# EAGLE design IMU CAN Speed Converter Board rev2 (EAGLE 9.6.2)
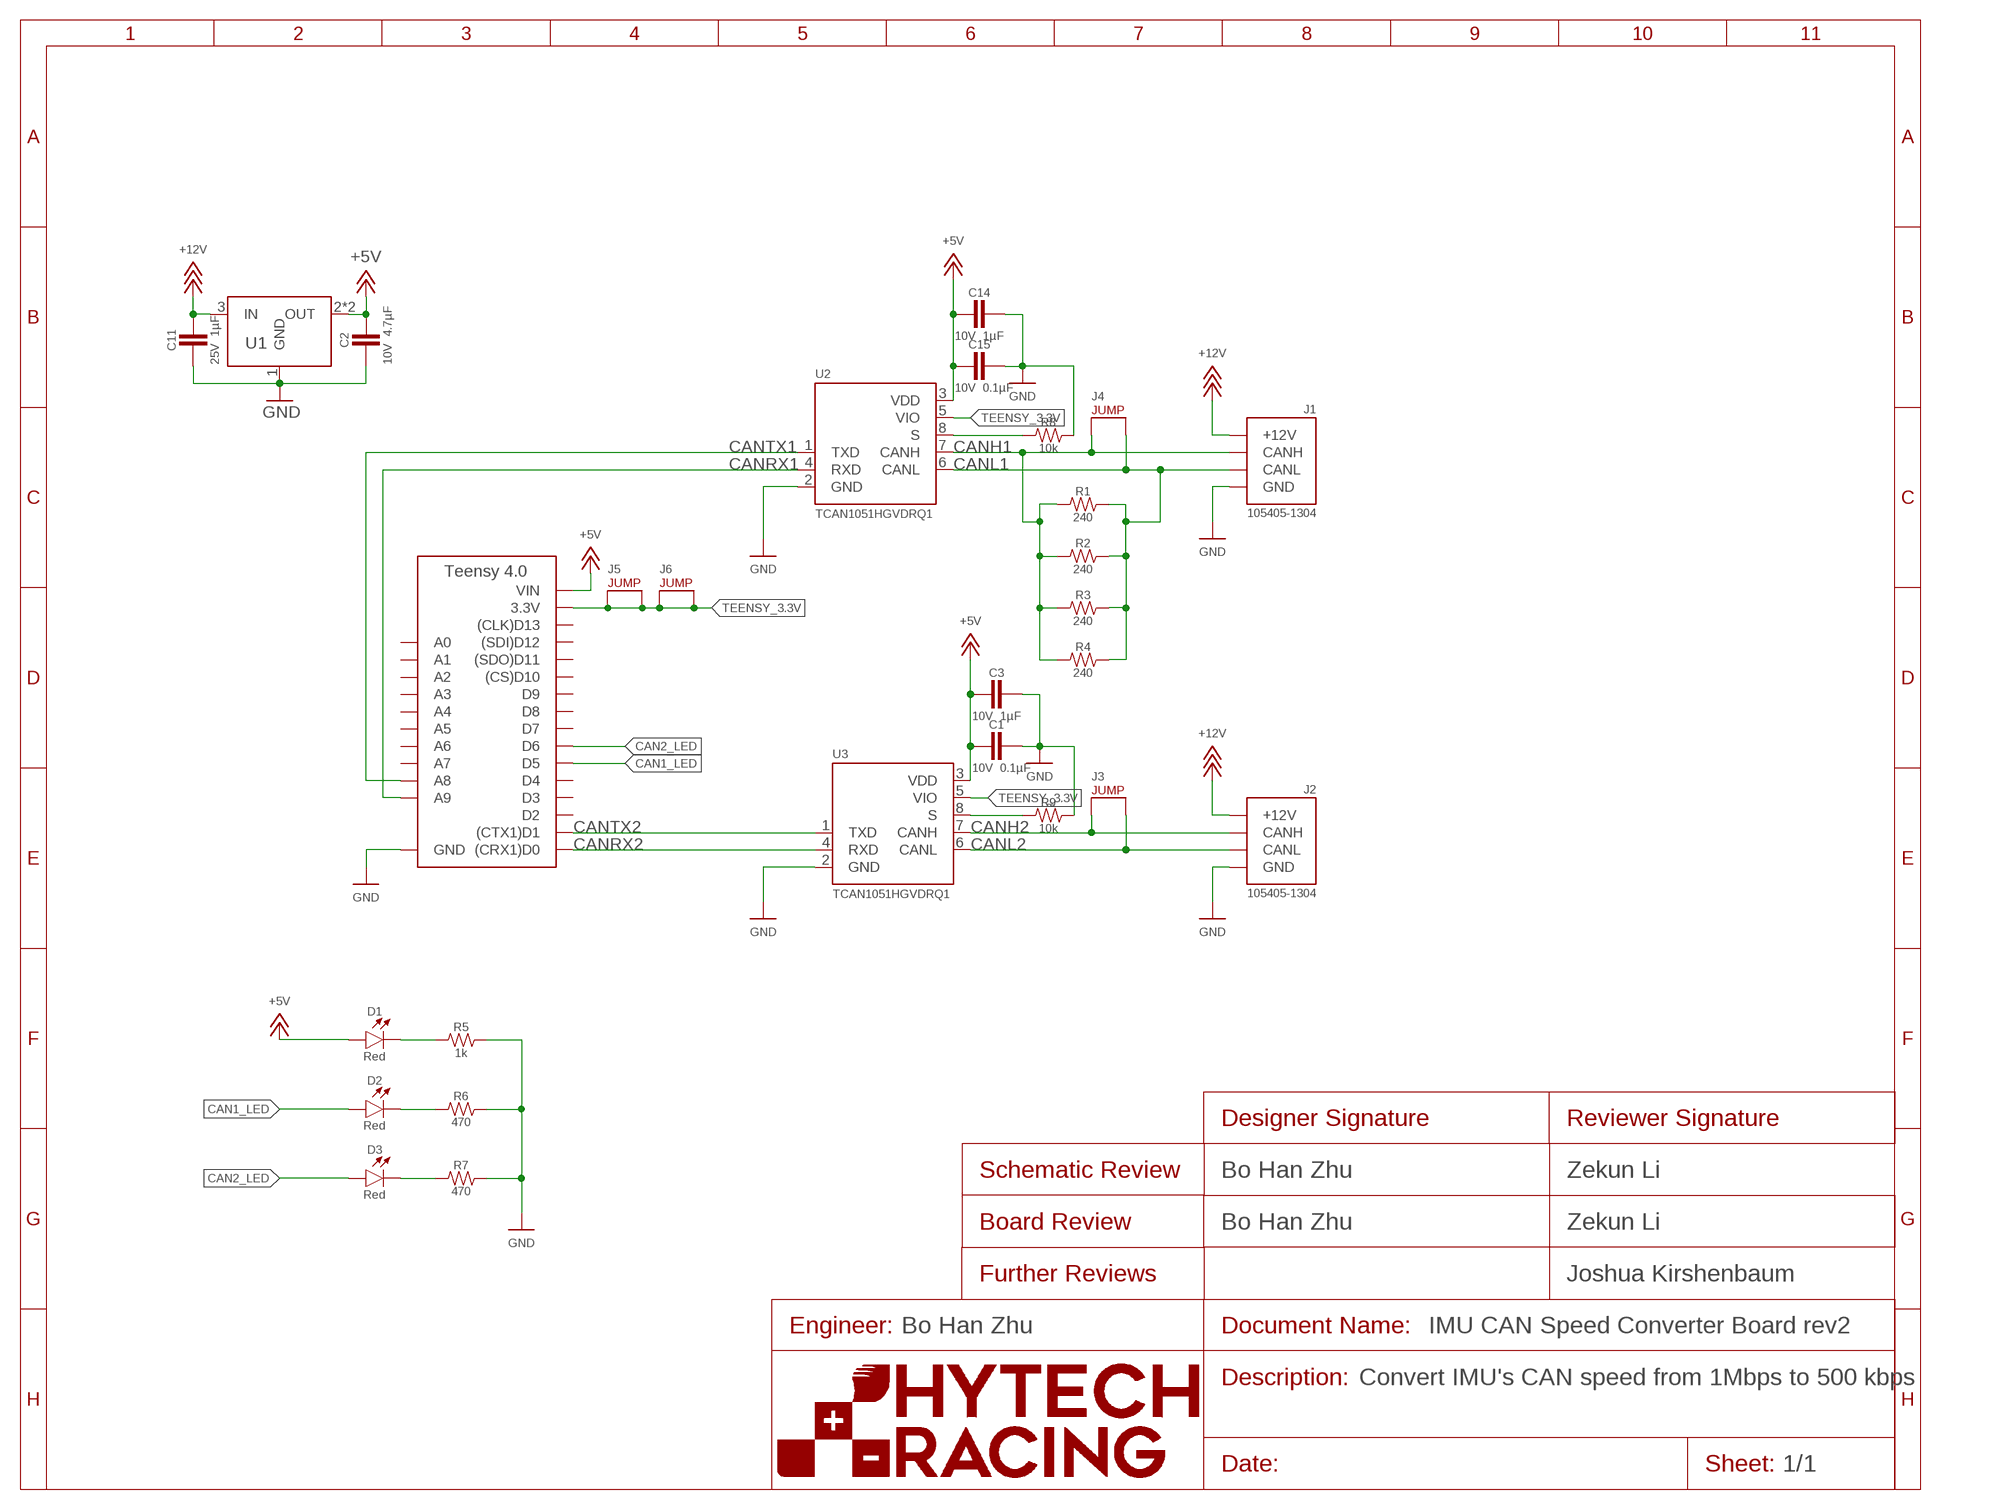
[diagram p0: schematic, sheet 1]
FRAME1 (FRAME): DESCRIPTION_1: Convert IMU's CAN speed from 1Mbps to 500 kbps; DESIGNER_BOARD: Bo Han Zhu; DESIGNER_SCHEMATIC: Bo Han Zhu; ENGINEER: Bo Han Zhu; REVIEWER_BOARD: Zekun Li; REVIEWER_FURTHER: Joshua Kirshenbaum; REVIEWER_SCHEMATIC: Zekun Li

## Parts
A1  TEENSY_4.0  [TEENSY_SHORT]
C1  CAPACITOR_0603_10V_0.1UF  [0603-CAP]
C2  CAPACITOR_0603_10V_4.7UF  [0603-CAP]
C3  CAPACITOR_0603_10V_1UF  [0603-CAP]
C11  CAPACITOR_0603_25V_1UF  [0603-CAP]
C14  CAPACITOR_0603_10V_1UF  [0603-CAP]
C15  CAPACITOR_0603_10V_0.1UF  [0603-CAP]
D1  LED_0603_RED  [0603-LED]
D2  LED_0603_RED  [0603-LED]
D3  LED_0603_RED  [0603-LED]
J1  CONNECTOR-CAN_NF_S_RA_BLACK  [MOLEX_NANOFIT_SMD_RIGHTANGLE_04]
J2  CONNECTOR-CAN_NF_S_RA_BLACK  [MOLEX_NANOFIT_SMD_RIGHTANGLE_04]
J3  JUMPER_1X02_  [1X02]
J4  JUMPER_1X02_  [1X02]
J5  JUMPER_1X02_  [1X02]
J6  JUMPER_1X02_  [1X02]
R1  RESISTOR_0603_240  [0603-RES]
R2  RESISTOR_0603_240  [0603-RES]
R3  RESISTOR_0603_240  [0603-RES]
R4  RESISTOR_0603_240  [0603-RES]
R5  RESISTOR_0603_1K  [0603-RES]
R6  RESISTOR_0603_470  [0603-RES]
R7  RESISTOR_0603_470  [0603-RES]
R8  RESISTOR_0603_10K  [0603-RES]
R9  RESISTOR_0603_10K  [0603-RES]
U1  VOLTAGE_REGULATOR_SOT223_5V  [SOT223]
U2  TCAN1051HQV-Q1  [SOIC-08(NARROW,0.15")]
U3  TCAN1051HQV-Q1  [SOIC-08(NARROW,0.15")]

## Nets
+5V: A1.VIN C1.2 C2.1 C3.2 C14.2 C15.2 D1.2(A) U1.2(OUT) U1.4(OUT) U2.3(VDD) U3.3(VDD)
+12V: C11.1 J1.1(+12V) J2.1(+12V) U1.3(IN)
CAN1_LED: A1.D5 D2.2(A)
CAN2_LED: A1.D6 D3.2(A)
CANH1: J1.4(CANH) J4.1 R1.1 R2.1 R3.1 R4.1 U2.7(CANH)
CANH2: J2.4(CANH) J3.1 U3.7(CANH)
CANL1: J1.3(CANL) J4.2 R1.2 R2.2 R3.2 R4.2 U2.6(CANL)
CANL2: J2.3(CANL) J3.2 U3.6(CANL)
CANRX1: A1.D23(A9) U2.4(RXD)
CANRX2: A1.D0((CRX1)D0) U3.4(RXD)
CANTX1: A1.D22(A8) U2.1(TXD)
CANTX2: A1.D1((CTX1)D1) U3.1(TXD)
GND: A1.AGND/GND(GND) A1.GND C1.1 C2.2 C3.1 C11.2 C14.1 C15.1 J1.2(GND) J2.2(GND) R5.2 R6.2 R7.2 R8.2 R9.2 U1.1(GND) U2.2(GND) U3.2(GND)
N$1: D1.1(C) R5.1
N$2: D2.1(C) R6.1
N$3: D3.1(C) R7.1
N$4: R9.1 U3.8(S)
N$5: R8.1 U2.8(S)
TEENSY_3.3V: A1.3.3V J5.1 J5.2 J6.1 J6.2 U2.5(VIO) U3.5(VIO)
Unconnected: A1.D2 A1.D3 A1.D4 A1.D7 A1.D8 A1.D9 A1.D10((CS)D10) A1.D11((SDO)D11) A1.D12((SDI)D12) A1.D13((CLK)D13) A1.D14(A0) A1.D15(A1) A1.D16(A2) A1.D17(A3) A1.D18(A4) A1.D19(A5) A1.D20(A6) A1.D21(A7)

## Library data of the parts
A1 = HyTechDevices:TEENSY_4.0: Teensy 4.0 Datasheet <https://www.pjrc.com/store/teensy40.html>
C1 C15 = HyTechDevices:CAPACITOR_?_*: Capacitor, Non-Polarized VJ...1BC Series Datasheet <https://www.mouser.com/datasheet/2/427/vjw1bcbascomseries-1762447.pdf> Samsung Datasheet <https://www.mouser.com/datasheet/2/585/MLCC-1837944.pdf> Walsin Datasheet <https://www.mouser.com/datasheet/2/210/WTC_MLCC_General_Purpose-1534899.pdf> GRM188R61A226ME15D <https://www.mouser.com/datasheet/2/281/1/GRM188R61A226ME15_02A-1985787.pdf> GRM188R61E106MA73D <https://www.mouser.com/datasheet/2/281/1/GRM188R61E106MA73_01A-1985806.pdf> 885012006013 <https://www.mouser.com/datasheet/2/445/885012006013-1726946.pdf> 2220Y6300105KXTWS2 <https://www.mouser.com/datasheet/2/218/SMD_High_and_Std_StackiCap_P62-1825512.pdf> Yageo Class 2, X5R <https://www.mouser.com/datasheet/2/447/UPY_GPHC_X5R_4V_to_50V_26-1827097.pdf> TDK C Series <https://www.mouser.com/ProductDetail/TDK/C3216X5R1V226M160AC?qs=%2Fha2pyFadujbcx9jh7lYl%2F4NeMoXFhdc8AqVWNq4wW6M2y7zl6GzBuhgtI0ngznN> AVX Automotive MLCC <https://www.mouser.com/datasheet/2/40/AutoMLCC-777028.pdf> KEMET X7R Series <https://www.mouser.com/datasheet/2/212/KEM_C1002_X7R_SMD-1102033.pdf>; CAPACITANCE: 0.1µF; DKPN: 720-1688-1-ND; MANUFACTURER: Vishay Vitramon; MOPN: 77-VJ0603Y104JXQPBC; MPN: VJ0603Y104JXQPW1BC; TOLERANCE: 5%; VOLTAGE: 10V
C2 = HyTechDevices:CAPACITOR_?_*: Capacitor, Non-Polarized VJ...1BC Series Datasheet <https://www.mouser.com/datasheet/2/427/vjw1bcbascomseries-1762447.pdf> Samsung Datasheet <https://www.mouser.com/datasheet/2/585/MLCC-1837944.pdf> Walsin Datasheet <https://www.mouser.com/datasheet/2/210/WTC_MLCC_General_Purpose-1534899.pdf> GRM188R61A226ME15D <https://www.mouser.com/datasheet/2/281/1/GRM188R61A226ME15_02A-1985787.pdf> GRM188R61E106MA73D <https://www.mouser.com/datasheet/2/281/1/GRM188R61E106MA73_01A-1985806.pdf> 885012006013 <https://www.mouser.com/datasheet/2/445/885012006013-1726946.pdf> 2220Y6300105KXTWS2 <https://www.mouser.com/datasheet/2/218/SMD_High_and_Std_StackiCap_P62-1825512.pdf> Yageo Class 2, X5R <https://www.mouser.com/datasheet/2/447/UPY_GPHC_X5R_4V_to_50V_26-1827097.pdf> TDK C Series <https://www.mouser.com/ProductDetail/TDK/C3216X5R1V226M160AC?qs=%2Fha2pyFadujbcx9jh7lYl%2F4NeMoXFhdc8AqVWNq4wW6M2y7zl6GzBuhgtI0ngznN> AVX Automotive MLCC <https://www.mouser.com/datasheet/2/40/AutoMLCC-777028.pdf> KEMET X7R Series <https://www.mouser.com/datasheet/2/212/KEM_C1002_X7R_SMD-1102033.pdf>; CAPACITANCE: 4.7µF; DKPN: 1276-1044-1-ND; MANUFACTURER: Samsung Electro-Mechanics; MOPN: 187-CL10A475KP8NNNC; MPN: CL10A475KP8NNNC; TOLERANCE: 10%; VOLTAGE: 10V
C3 C14 = HyTechDevices:CAPACITOR_?_*: Capacitor, Non-Polarized VJ...1BC Series Datasheet <https://www.mouser.com/datasheet/2/427/vjw1bcbascomseries-1762447.pdf> Samsung Datasheet <https://www.mouser.com/datasheet/2/585/MLCC-1837944.pdf> Walsin Datasheet <https://www.mouser.com/datasheet/2/210/WTC_MLCC_General_Purpose-1534899.pdf> GRM188R61A226ME15D <https://www.mouser.com/datasheet/2/281/1/GRM188R61A226ME15_02A-1985787.pdf> GRM188R61E106MA73D <https://www.mouser.com/datasheet/2/281/1/GRM188R61E106MA73_01A-1985806.pdf> 885012006013 <https://www.mouser.com/datasheet/2/445/885012006013-1726946.pdf> 2220Y6300105KXTWS2 <https://www.mouser.com/datasheet/2/218/SMD_High_and_Std_StackiCap_P62-1825512.pdf> Yageo Class 2, X5R <https://www.mouser.com/datasheet/2/447/UPY_GPHC_X5R_4V_to_50V_26-1827097.pdf> TDK C Series <https://www.mouser.com/ProductDetail/TDK/C3216X5R1V226M160AC?qs=%2Fha2pyFadujbcx9jh7lYl%2F4NeMoXFhdc8AqVWNq4wW6M2y7zl6GzBuhgtI0ngznN> AVX Automotive MLCC <https://www.mouser.com/datasheet/2/40/AutoMLCC-777028.pdf> KEMET X7R Series <https://www.mouser.com/datasheet/2/212/KEM_C1002_X7R_SMD-1102033.pdf>; CAPACITANCE: 1µF; DKPN: 311-1796-1-ND; MANUFACTURER: Yageo; MOPN: 603-CC603KRX7R6BB105; MPN: CC0603KRX7R6BB105; TOLERANCE: 10%; VOLTAGE: 10V
C11 = HyTechDevices:CAPACITOR_?_*: Capacitor, Non-Polarized VJ...1BC Series Datasheet <https://www.mouser.com/datasheet/2/427/vjw1bcbascomseries-1762447.pdf> Samsung Datasheet <https://www.mouser.com/datasheet/2/585/MLCC-1837944.pdf> Walsin Datasheet <https://www.mouser.com/datasheet/2/210/WTC_MLCC_General_Purpose-1534899.pdf> GRM188R61A226ME15D <https://www.mouser.com/datasheet/2/281/1/GRM188R61A226ME15_02A-1985787.pdf> GRM188R61E106MA73D <https://www.mouser.com/datasheet/2/281/1/GRM188R61E106MA73_01A-1985806.pdf> 885012006013 <https://www.mouser.com/datasheet/2/445/885012006013-1726946.pdf> 2220Y6300105KXTWS2 <https://www.mouser.com/datasheet/2/218/SMD_High_and_Std_StackiCap_P62-1825512.pdf> Yageo Class 2, X5R <https://www.mouser.com/datasheet/2/447/UPY_GPHC_X5R_4V_to_50V_26-1827097.pdf> TDK C Series <https://www.mouser.com/ProductDetail/TDK/C3216X5R1V226M160AC?qs=%2Fha2pyFadujbcx9jh7lYl%2F4NeMoXFhdc8AqVWNq4wW6M2y7zl6GzBuhgtI0ngznN> AVX Automotive MLCC <https://www.mouser.com/datasheet/2/40/AutoMLCC-777028.pdf> KEMET X7R Series <https://www.mouser.com/datasheet/2/212/KEM_C1002_X7R_SMD-1102033.pdf>; CAPACITANCE: 1µF; DKPN: 1276-1184-1-ND; MANUFACTURER: Samsung Electro-Mechanics; MOPN: 187-CL10B105KA8NNNC; MPN: CL10B105KA8NNNC; TOLERANCE: 10%; VOLTAGE: 25V
D1-D3 = HyTechDevices:LED_?_*: LED Blue <https://www.mouser.com/datasheet/2/216/APT1608VBC_D-246010.pdf> Green <https://www.mouser.com/datasheet/2/216/APT1608ZGCK-1173388.pdf> Orange <https://www.mouser.com/datasheet/2/216/APT1608SECK-6197.pdf> Red <https://www.mouser.com/datasheet/2/216/APT1608SECK-J3-PRV-1173336.pdf> White <https://www.mouser.com/datasheet/2/50/SM0603UWC-880813.pdf> Yellow <https://www.mouser.com/datasheet/2/216/APT1608SYCK-J3-PRV-1173311.pdf>; COLOR: Red; DKPN: 754-1786-1-ND; MANUFACTURER: Kingbright; MOPN: 604-APT1608SECKJ3PRV; MPN: APT1608SECK/J3-PRV
J1 J2 = HyTechDevices:CONNECTOR-CAN_?_*: HyTech CAN Connector; MANUFACTURER: Molex; MPN: 105405-1304
J3-J6 = HyTechDevices:JUMPER_?_*: 2 Pin Connector
R1-R4 = HyTechDevices:RESISTOR_?_*: Resistor PWR163 Series <https://www.mouser.com/datasheet/2/54/pwr163-777985.pdf> AC Series <https://www.mouser.com/datasheet/2/447/Yageo_PYu_AC_51_RoHS_L_7_1714230-1874691.pdf> PU Series <https://www.mouser.com/datasheet/2/447/PYu-PU_51_RoHS_L_6-1504619.pdf> ERA Series <https://www.mouser.com/datasheet/2/315/AOA0000C307-1149632.pdf> PWR263 Series <https://www.mouser.com/datasheet/2/54/pwr263s_35-778069.pdf> RC Series <https://www.mouser.com/datasheet/2/447/Yageo_03_18_2021_PYu_RC_Group_51_RoHS_L_11-2199992.pdf> ERJ PB3, PB6 Series <https://www.mouser.com/datasheet/2/315/AOA0000C328-1530132.pdf> ERJ PA2, P03, PA3, P06, P08, P14 Series <https://www.mouser.com/datasheet/2/315/AOA0000C331-1141874.pdf>; DKPN: 311-240HRCT-ND; MANUFACTURER: Yageo; MOPN: 603-RC0603FR-07240RL; MPN: RC0603FR-07240RL; POWER: 0.1W; RESISTANCE: 240; TOLERANCE: 1%; VOLTAGE_CONTINUOUS: 4.90V; VOLTAGE_MAX: 75V
R5 = HyTechDevices:RESISTOR_?_*: Resistor PWR163 Series <https://www.mouser.com/datasheet/2/54/pwr163-777985.pdf> AC Series <https://www.mouser.com/datasheet/2/447/Yageo_PYu_AC_51_RoHS_L_7_1714230-1874691.pdf> PU Series <https://www.mouser.com/datasheet/2/447/PYu-PU_51_RoHS_L_6-1504619.pdf> ERA Series <https://www.mouser.com/datasheet/2/315/AOA0000C307-1149632.pdf> PWR263 Series <https://www.mouser.com/datasheet/2/54/pwr263s_35-778069.pdf> RC Series <https://www.mouser.com/datasheet/2/447/Yageo_03_18_2021_PYu_RC_Group_51_RoHS_L_11-2199992.pdf> ERJ PB3, PB6 Series <https://www.mouser.com/datasheet/2/315/AOA0000C328-1530132.pdf> ERJ PA2, P03, PA3, P06, P08, P14 Series <https://www.mouser.com/datasheet/2/315/AOA0000C331-1141874.pdf>; DKPN: 311-1.00KHRCT-ND; MANUFACTURER: Yageo; MOPN: 603-RC0603FR-071KL; MPN: RC0603FR-071KL; POWER: 0.1W; RESISTANCE: 1k; TOLERANCE: 1%; VOLTAGE_CONTINUOUS: 10.00V; VOLTAGE_MAX: 75V
R6 R7 = HyTechDevices:RESISTOR_?_*: Resistor PWR163 Series <https://www.mouser.com/datasheet/2/54/pwr163-777985.pdf> AC Series <https://www.mouser.com/datasheet/2/447/Yageo_PYu_AC_51_RoHS_L_7_1714230-1874691.pdf> PU Series <https://www.mouser.com/datasheet/2/447/PYu-PU_51_RoHS_L_6-1504619.pdf> ERA Series <https://www.mouser.com/datasheet/2/315/AOA0000C307-1149632.pdf> PWR263 Series <https://www.mouser.com/datasheet/2/54/pwr263s_35-778069.pdf> RC Series <https://www.mouser.com/datasheet/2/447/Yageo_03_18_2021_PYu_RC_Group_51_RoHS_L_11-2199992.pdf> ERJ PB3, PB6 Series <https://www.mouser.com/datasheet/2/315/AOA0000C328-1530132.pdf> ERJ PA2, P03, PA3, P06, P08, P14 Series <https://www.mouser.com/datasheet/2/315/AOA0000C331-1141874.pdf>; DKPN: P470BYCT-ND; MANUFACTURER: Panasonic Electronic Components; MOPN: 667-ERJ-PA3F4700V; MPN: ERJ-PA3F4700V; POWER: 0.25W; RESISTANCE: 470; TOLERANCE: 1%; VOLTAGE_CONTINUOUS: 10.84V; VOLTAGE_MAX: 150V
R8 R9 = HyTechDevices:RESISTOR_?_*: Resistor PWR163 Series <https://www.mouser.com/datasheet/2/54/pwr163-777985.pdf> AC Series <https://www.mouser.com/datasheet/2/447/Yageo_PYu_AC_51_RoHS_L_7_1714230-1874691.pdf> PU Series <https://www.mouser.com/datasheet/2/447/PYu-PU_51_RoHS_L_6-1504619.pdf> ERA Series <https://www.mouser.com/datasheet/2/315/AOA0000C307-1149632.pdf> PWR263 Series <https://www.mouser.com/datasheet/2/54/pwr263s_35-778069.pdf> RC Series <https://www.mouser.com/datasheet/2/447/Yageo_03_18_2021_PYu_RC_Group_51_RoHS_L_11-2199992.pdf> ERJ PB3, PB6 Series <https://www.mouser.com/datasheet/2/315/AOA0000C328-1530132.pdf> ERJ PA2, P03, PA3, P06, P08, P14 Series <https://www.mouser.com/datasheet/2/315/AOA0000C331-1141874.pdf>; DKPN: 311-10.0KHRCT-ND; MANUFACTURER: Yageo; MOPN: 603-RC0603FR-0710KL; MPN: RC0603FR-0710KL; POWER: 0.1W; RESISTANCE: 10k; TOLERANCE: 1%; VOLTAGE_CONTINUOUS: 31.62V; VOLTAGE_MAX: 75V
U1 = HyTechDevices:VOLTAGE_REGULATOR_?_*: Voltage Regulators LDL1117S50R Datasheet <https://www.mouser.com/datasheet/2/389/dm00366442-1799212.pdf> NCP785AH120T1G <https://www.mouser.com/datasheet/2/308/NCP785A_D-1812704.pdf>; DKPN: 497-17240-1-ND; MANUFACTURER: STMicroelectronics; MOPN: 511-LDL1117S50R; MPN: LDL1117S50R
U2 U3 = HyTechDevices:TCAN1051*V-Q1: TCAN1051*V Can Tranciever Datasheet <https://www.ti.com/lit/ds/symlink/tcan1051hgv-q1.pdf?HQS=dis-mous-null-mousermode-dsf-pf-null-wwe&ts=1610765132518&ref_url=https%253A%252F%252Fwww.mouser.com%252Ff>; DKPN: 296-49935-1-ND; MANUFACTURER: Texas Instruments; MOPN: 595-TCAN1051HGVDQ1; MPN: TCAN1051HGVDRQ1

## Board
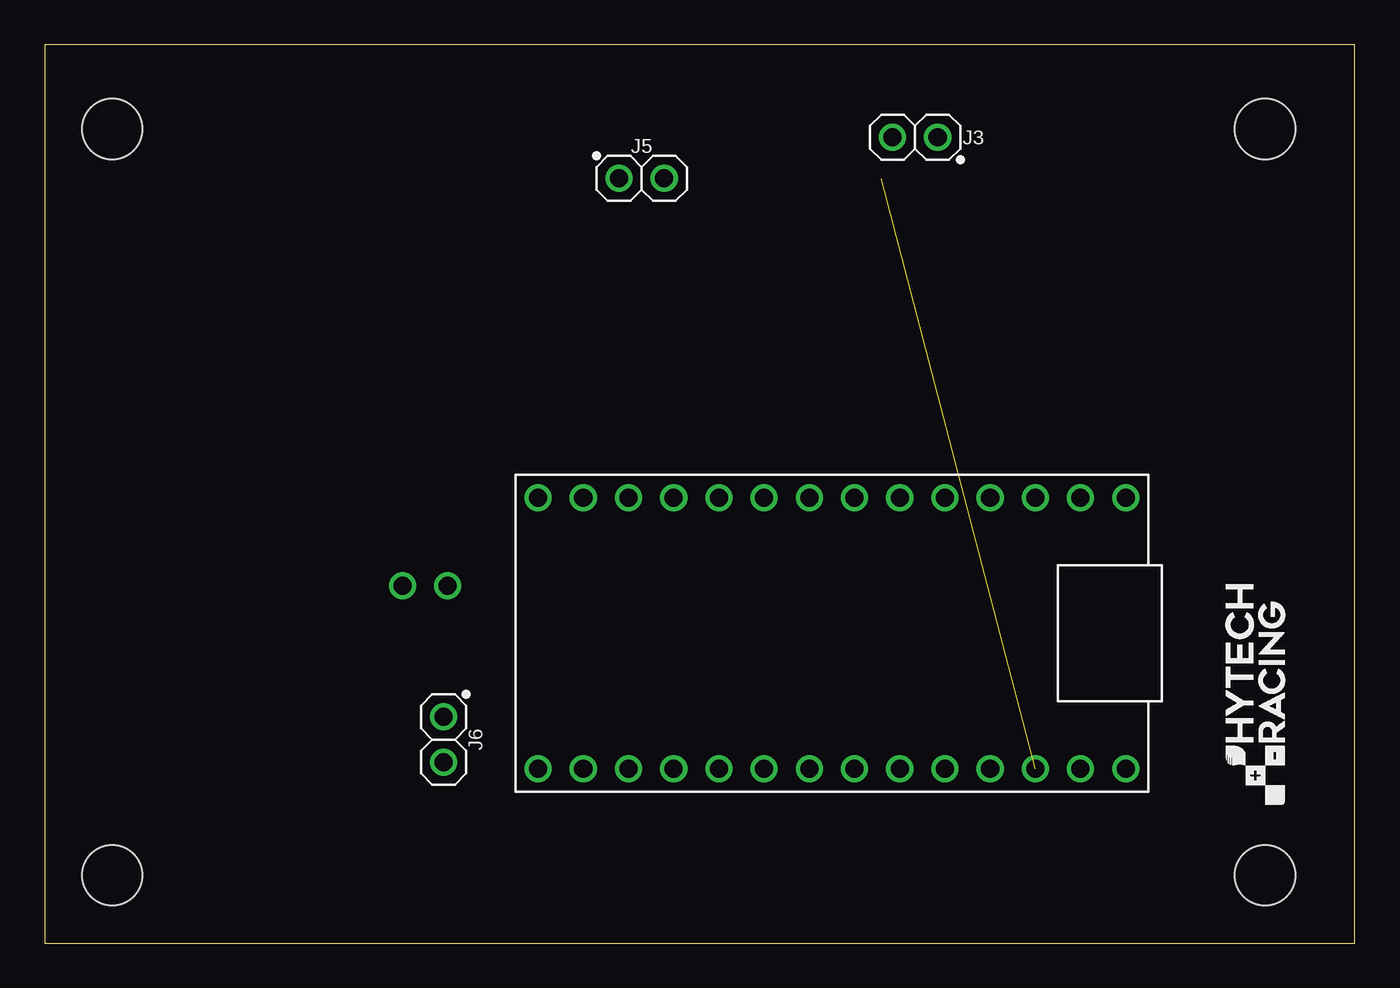
[diagram p1: board, top side]
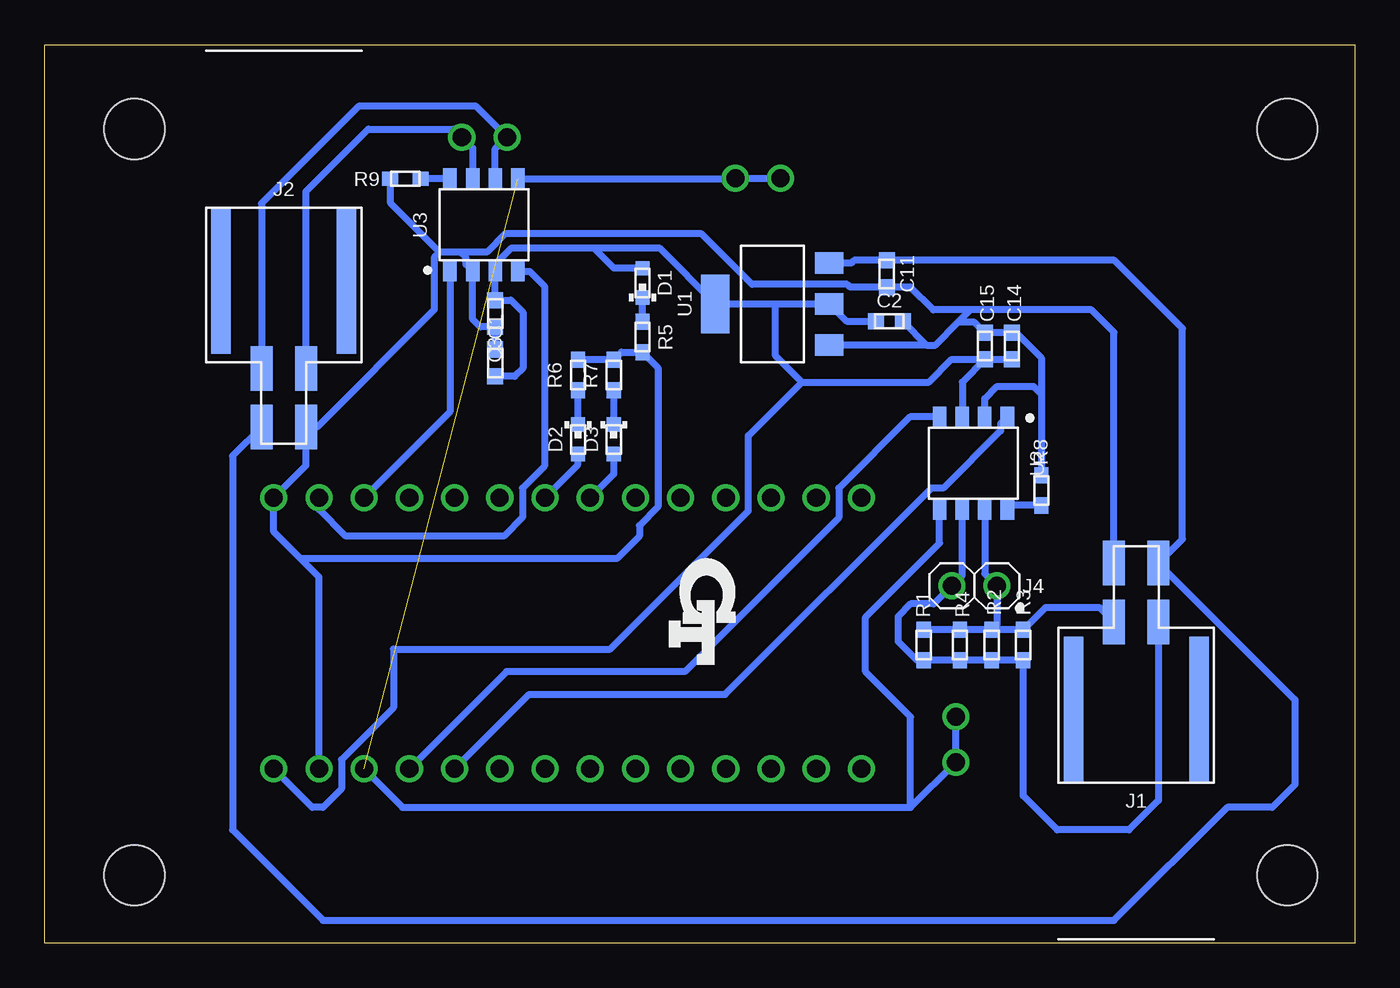
[diagram p2: board, bottom side, seen from below]

Size 73.64 x 50.47 mm. Coordinates in mm from the lower left corner, seen from the top.
Outline: 0,0 73.64,0 73.64,50.47 0,50.47 0,0
Copper layers 16: Bottom 0.035mm
Design rules "On Campus (1 Layer)": minimum track width 16mil, minimum drill 0.8mm, track to track 16mil, track to pad 12mil, pad to pad 16mil, via to via 16mil, smd to smd 10mil, copper to edge 40mil, drill to drill 10mil, minimum pad ring 10mil, minimum via ring 8mil, stop-mask expansion 4mil, vias tented up to drill 0mil, thermal gap 10mil

### Footprints (pad centres in the part's own frame; a part is rotated, then mirrored left to right if it is on the bottom)
TEENSY_SHORT = drill 1.016: 3.3V 0,5.08; AGND/GND 0,2.54; D0 15.24,2.54; D1 15.24,5.08; D2 15.24,7.62; D3 15.24,10.16; D4 15.24,12.7; D5 15.24,15.24; D6 15.24,17.78; D7 15.24,20.32; D8 15.24,22.86; D9 15.24,25.4; D10 15.24,27.94; D11 15.24,30.48; D12 15.24,33.02; D13 0,33.02; D14 0,30.48; D15 0,27.94; D16 0,25.4; D17 0,22.86; D18 0,20.32; D19 0,17.78; D20 0,15.24; D21 0,12.7; D22 0,10.16; D23 0,7.62; GND 15.24,0; VIN 0,0
0603-CAP = smd 0.9 x 0.9: 1 -0.75,0; 2 0.75,0
0603-LED = smd 0.8 x 0.8: 1 -0.825,0; 2 0.825,0
MOLEX_NANOFIT_SMD_RIGHTANGLE_04 = smd 1.24 x 2.5: 1 1.25,1.65; 2 -1.25,1.65; 3 1.25,-1.65; 4 -1.25,-1.65 | smd 1.1 x 8.2: PAD1 -3.52,-6.58; PAD@1 3.52,-6.58
1X02 = drill 1.016: 1 -1.27,0; 2 1.27,0
0603-RES = smd 0.9 x 0.8: 1 -0.85,0; 2 0.85,0
SOT223 = smd 1.2 x 1.6: 1 -2.3,-3.2; 2 0,-3.2; 3 2.3,-3.2 | smd 3.3 x 1.6: 4 0,3.2
SOIC-08(NARROW,0.15") = smd 0.762 x 1.143: 1 -1.905,-2.603; 2 -0.635,-2.603; 3 0.635,-2.603; 4 1.905,-2.603; 5 1.905,2.603; 6 0.635,2.603; 7 -0.635,2.603; 8 -1.905,2.603
MOUNTING_M3 = hole 3.4: 0,0

### Placement (x,y rotation side)
A1  60.76,9.78 90 top
C1  48.31,32.59 270 bottom
C2  26.16,34.92 0 bottom
C3  48.31,35.36 90 bottom
C11  26.31,37.59 270 bottom
C14  19.28,33.53 270 bottom
C15  20.8,33.53 270 bottom
D1  40.03,37.08 90 bottom
D2  43.66,28.3 270 bottom
D3  41.66,28.3 270 bottom
J1  12.29,19.68 0 bottom
J2  60.2,30.63 180 bottom
J3  48.92,45.26 180 top
J4  21.39,20.07 180 bottom
J5  33.55,42.95 0 top
J6  22.43,11.43 270 top
R1  24.23,16.74 270 bottom
R2  20.42,16.74 270 bottom
R3  18.64,16.74 270 bottom
R4  22.2,16.74 270 bottom
R5  40.03,34.04 270 bottom
R6  43.66,31.9 90 bottom
R7  41.66,31.9 90 bottom
R8  17.63,25.43 90 bottom
R9  53.37,42.93 180 bottom
U1  32.74,35.89 90 bottom
U2  21.44,26.95 180 bottom
U3  48.95,40.34 0 bottom
U$1  [MOUNTING_M3]  68.58,3.81 0 top
U$2  [MOUNTING_M3]  3.81,45.72 0 top
U$3  [LOGO_HYTECH_0.5"]  69.85,7.62 90 top
U$4  [MOUNTING_M3]  3.81,3.81 0 top
U$5  [MOUNTING_M3]  68.58,45.72 0 top
U$6  [LOGO_GT_0.25"]  36.68,18.62 270 bottom

### Tracks (layer width: path | path; a pad name or v marks a point on that pad's centre or on a via)
+5V
  Bottom 0.406: 32.59,35.89 U1.2 28.57,34.92 C2.1 | 32.59,35.89 U1.4 39.06,39.01 42.75,39.01 | C15.2 C14.2 | U2.3 22.07,31.51 C15.2 | C1.2 48.3,31.83 47.22,31.83 46.76,32.28 46.76,35.43 47.44,36.11 C3.2 U3.3 48.31,38.13 47.43,39.01 42.75,39.01 | C15.2 22.67,32.78 23.94,31.51 31.08,31.51 | 32.59,35.89 32.59,33.02 31.08,31.51 | D1.2 41.64,37.91 42.75,39.01 | A1.VIN 58.6,7.62 57.99,7.62 56.95,8.66 56.95,10.3 54.03,13.23 54.03,16.51 41.85,16.51 34.09,24.27 34.09,28.5 31.08,31.51
+12V
  Bottom 0.406: U1.3 28.3,38.19 28.15,38.34 C11.1 13.51,38.34 9.7,34.53 9.7,22.68 J1.1 3.38,13.67 3.38,8.89 4.65,7.62 7.19,7.62 13.54,1.27 57.99,1.27 63.07,6.35 63.07,27.36 J2.1
CAN1_LED
  Bottom 0.406: A1.D5 43.66,26.87 D2.2
CAN2_LED
  Bottom 0.406: D3.2 41.66,26.34 A1.D6
CANH1
  Bottom 0.406: J1.4 14.37,18.86 17.37,18.86 R3.1 R2.1 | R2.1 R4.1 R1.1 | R2.1 20.12,17.89 J4.1 20.8,20.75 U2.7
CANH2
  Bottom 0.406: J2.4 58.95,42.22 55.45,45.72 50.65,45.72 J3.1 49.58,44.65 U3.7
CANL1
  Bottom 0.406: U2.6 22.07,20.65 J4.2 23.67,19.05 24.97,19.05 25.68,18.34 25.68,16.94 24.63,15.89 R1.2 R4.2 R2.2 R3.2 18.64,8.27 16.73,6.35 12.7,6.35 11.04,8.01 J1.3
CANL2
  Bottom 0.406: J2.3 61.45,41.54 56,46.99 49.38,46.99 J3.2 48.31,44.6 U3.6
CANRX1
  Bottom 0.406: A1.D23 47.68,15.24 37.66,15.24 29.01,23.89 29.01,25.55 25,29.55 U2.4
CANRX2
  Bottom 0.406: U3.4 46.38,37.73 45.54,36.89 45.54,26.79 46.79,25.55 46.79,23.9 47.83,22.86 56.72,22.86 58.22,24.36 A1.D0
CANTX1
  Bottom 0.406: U2.1 19.91,29.17 19.91,28.77 23.13,25.55 23.81,25.55 35.39,13.97 46.41,13.97 A1.D22
CANTX2
  Bottom 0.406: A1.D1 50.85,29.84 U3.1
GND
  Bottom 0.406: J1.2 13.54,34.3 14.81,35.56 21.6,35.56 | 22.3,34.86 23.57,33.59 24.08,33.59 | 22.3,34.86 21.6,35.56 | 24.08,33.59 U1.1 | C1.1 C3.1 49.16,34.61 49.58,35.03 U3.2 49.96,38.11 49.96,38.51 50.26,38.81 | 21.6,35.56 23.7,35.56 24.98,36.84 C11.2 28.37,36.84 28.53,37 33.88,37 36.71,39.83 47.77,39.83 48.78,38.81 50.26,38.81 | C2.2 24.08,33.59 | 50.26,38.81 51.44,38.81 | 51.44,38.81 51.74,38.51 51.74,35.57 58.33,28.98 J2.2 58.95,26.83 A1.GND 60.76,23.09 59.26,21.59 | R9.2 54.22,41.58 51.44,38.81 | 22.3,34.86 21.39,34.86 C15.1 C14.1 19.04,34.28 17.63,32.87 17.63,30.84 | 59.26,21.59 41.48,21.59 40.21,22.86 40.21,23.45 39.17,24.49 39.17,32.32 R5.2 41.22,33.19 R7.2 R6.2 | A1.AGND/GND 58.22,20.55 59.26,21.59 | 17.63,30.84 R8.2 | U2.2 20.8,30.58 20.12,31.27 18.06,31.27 17.63,30.84
N$1
  Bottom 0.406: R5.1 D1.1
N$2
  Bottom 0.406: D2.1 R6.1
N$3
  Bottom 0.406: R7.1 D3.1
N$4
  Bottom 0.406: U3.8 52.5,42.94 R9.1
N$5
  Bottom 0.406: R8.1 19.3,24.57 U2.8
TEENSY_3.3V  (1 unrouted)
  Bottom 0.406: A1.3.3V 53.52,7.62 24.97,7.62 | 24.97,7.62 24.97,12.7 27.51,15.24 27.51,18.3 23.34,22.47 U2.5 | U3.5 34.84,42.94 J5.2 J5.1 | 24.97,7.62 J6.2 J6.1

### Text on the board
tDocu: HyTech Racing 2022 / IMU CAN Speed Converter rev1 / Designed by Bo Han Zhu
bDocu: Connect to Vehicle CAN-Bus | Connect to IMU